# EAGLE schematic VSYNC_75px (EAGLE 9.4.2)
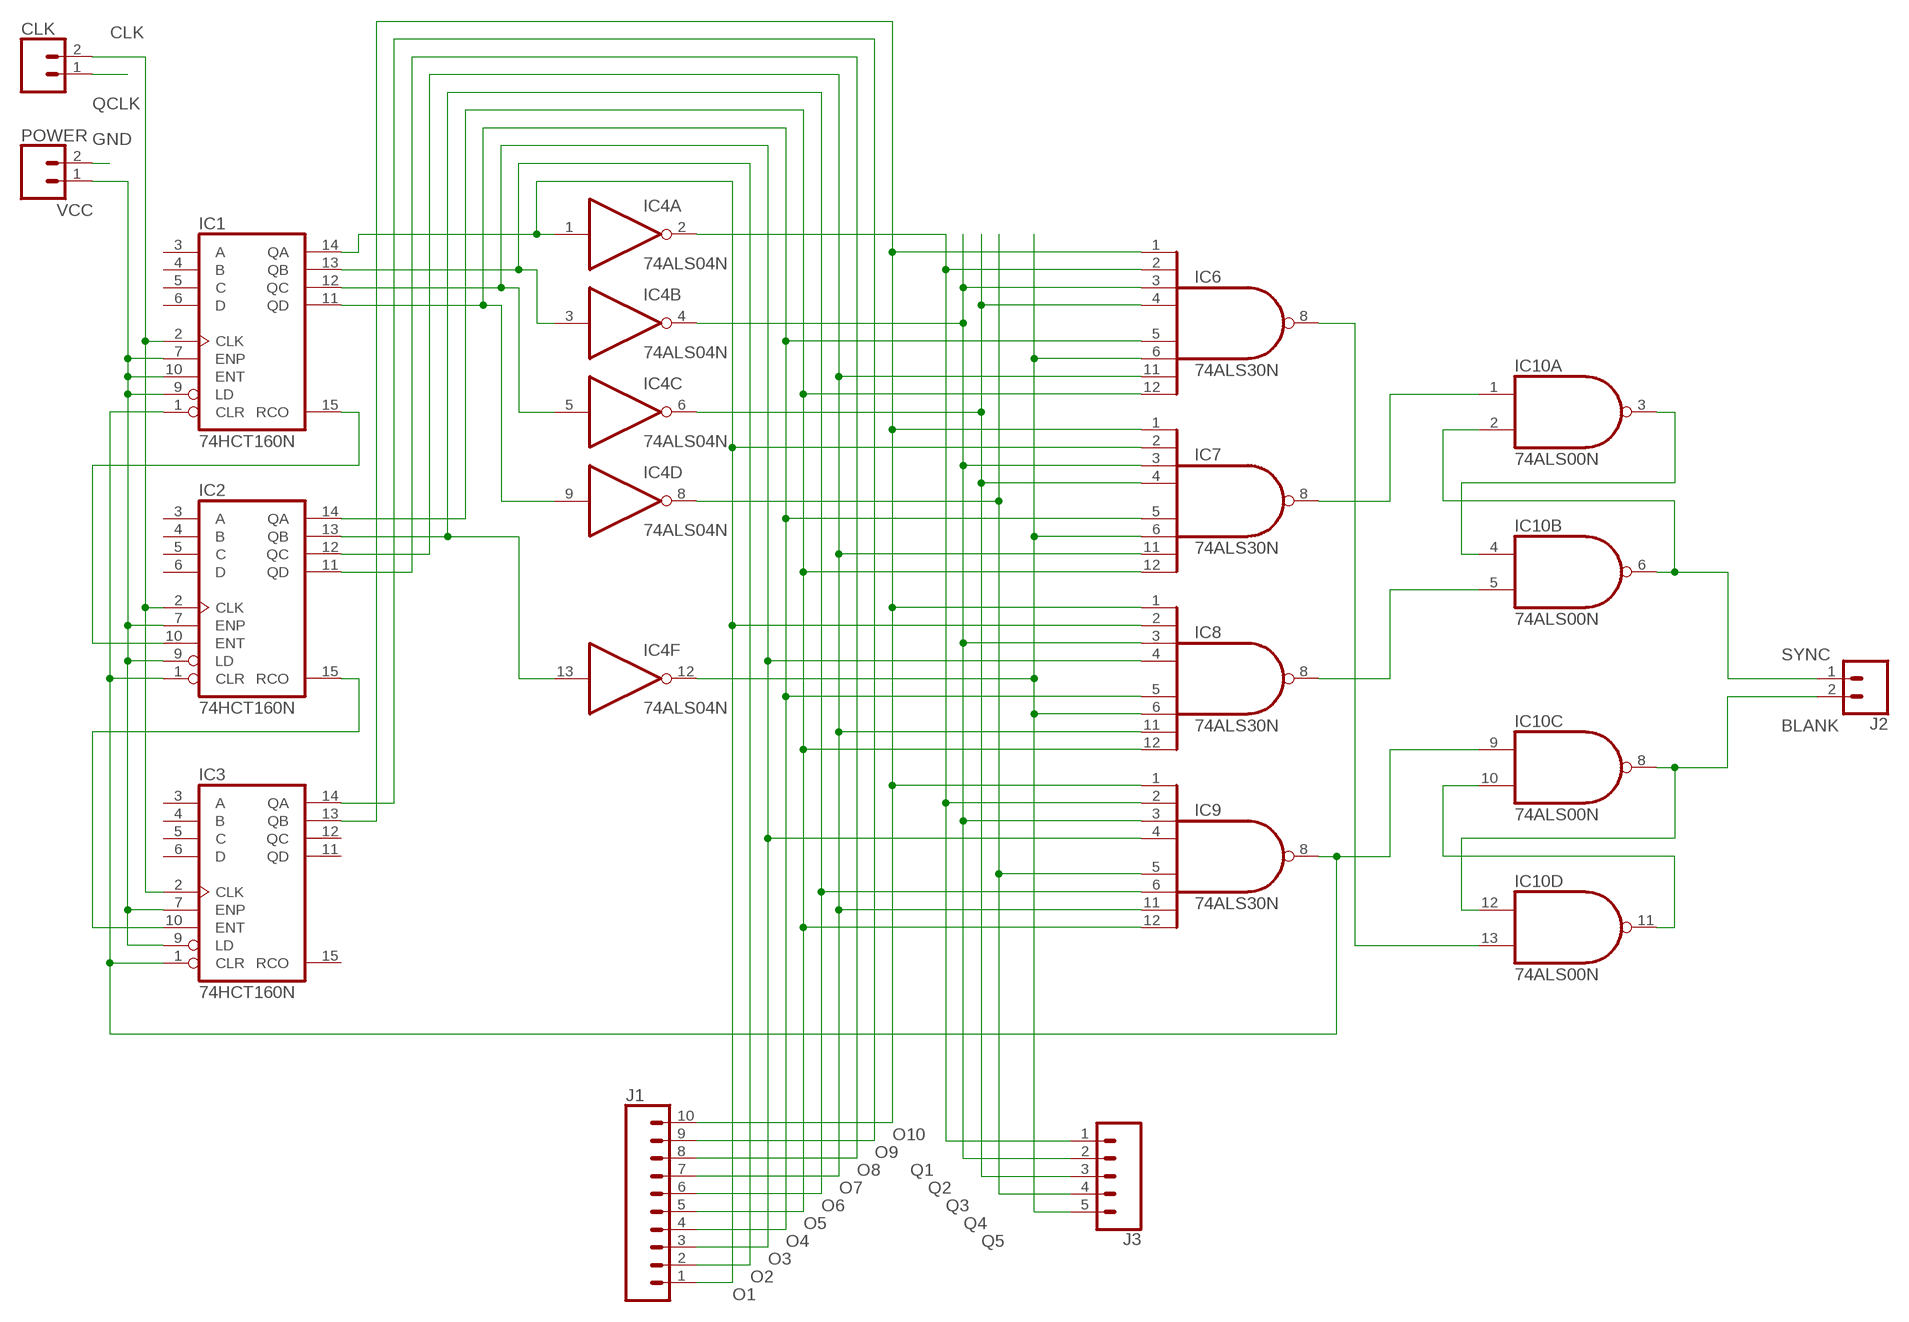
[diagram p0: schematic, sheet 1]

## Parts
CLK  CONN_02POGO_PIN_HOLES_ONLY  [1X02_PP_HOLES_ONLY]
IC1  74HCT160N  [DIL16]
IC2  74HCT160N  [DIL16]
IC3  74HCT160N  [DIL16]
IC4  74ALS04N  [DIL14]
IC6  74ALS30N  [DIL14]
IC7  74ALS30N  [DIL14]
IC8  74ALS30N  [DIL14]
IC9  74ALS30N  [DIL14]
IC10  74ALS00N  [DIL14]
J1  CONN_10"  [1X10]
J2  CONN_02POGO_PIN_HOLES_ONLY  [1X02_PP_HOLES_ONLY]
J3  CONN_05  [1X05]
POWER  CONN_02POGO_PIN_HOLES_ONLY  [1X02_PP_HOLES_ONLY]

## Nets
BLANK: IC10.8(C:O) IC10.12(D:I0) J2.2
CLK: CLK.2 IC1.2(CLK) IC2.2(CLK) IC3.2(CLK)
GND: POWER.2
MAX: IC1.1(CLR) IC2.1(CLR) IC3.1(CLR) IC9.8(O) IC10.9(C:I0)
N$3: IC1.15(RCO) IC2.10(ENT)
N$4: IC2.15(RCO) IC3.10(ENT)
N$24: IC7.8(O) IC10.1(A:I0)
N$25: IC8.8(O) IC10.5(B:I1)
N$26: IC10.3(A:O) IC10.4(B:I0)
N$28: IC6.8(O) IC10.13(D:I1)
N$32: IC10.10(C:I1) IC10.11(D:O)
O1: IC1.14(QA) IC4.1(A:I) IC7.2(I1) IC8.2(I1) J1.1
O2: IC1.13(QB) IC4.3(B:I) J1.2
O3: IC1.12(QC) IC4.5(C:I) IC8.4(I3) IC9.4(I3) J1.3
O4: IC1.11(QD) IC4.9(D:I) IC6.5(I4) IC7.5(I4) IC8.5(I4) J1.4
O5: IC2.14(QA) IC6.12(I7) IC7.12(I7) IC8.12(I7) IC9.12(I7) J1.5
O6: IC2.13(QB) IC4.13(F:I) IC9.6(I5) J1.6
O7: IC2.12(QC) IC6.11(I6) IC7.11(I6) IC8.11(I6) IC9.11(I6) J1.7
O8: IC2.11(QD) J1.8
O9: IC3.14(QA) J1.9
O10: IC3.13(QB) IC6.1(I0) IC7.1(I0) IC8.1(I0) IC9.1(I0) J1.10
Q1: IC4.2(A:O) IC6.2(I1) IC9.2(I1) J3.1
Q2: IC4.4(B:O) IC6.3(I2) IC7.3(I2) IC8.3(I2) IC9.3(I2) J3.2
Q3: IC4.6(C:O) IC6.4(I3) IC7.4(I3) J3.3
Q4: IC4.8(D:O) IC9.5(I4) J3.4
Q5: IC4.12(F:O) IC6.6(I5) IC7.6(I5) IC8.6(I5) J3.5
QCLK: CLK.1
SYNC: IC10.2(A:I1) IC10.6(B:O) J2.1
VCC: IC1.7(ENP) IC1.9(LD) IC1.10(ENT) IC2.7(ENP) IC2.9(LD) IC3.7(ENP) IC3.9(LD) POWER.1
Unconnected: IC1.3(A) IC1.4(B) IC1.5(C) IC1.6(D) IC2.3(A) IC2.4(B) IC2.5(C) IC2.6(D) IC3.3(A) IC3.4(B) IC3.5(C) IC3.6(D) IC3.11(QD) IC3.12(QC) IC3.15(RCO) IC4.10(E:O) IC4.11(E:I)

## Power pins joined to a net without a drawn wire
GND: IC1.8(GND) IC2.8(GND) IC3.8(GND) IC4.7(P:GND) IC6.7(GND) IC7.7(GND) IC8.7(GND) IC9.7(GND) IC10.7(P:GND)
VCC: IC1.16(VCC) IC2.16(VCC) IC3.16(VCC) IC4.14(P:VCC) IC6.14(VCC) IC7.14(VCC) IC8.14(VCC) IC9.14(VCC) IC10.14(P:VCC)

## Library data of the parts
CLK J2 POWER = SparkFun-Connectors:CONN_02: Multi connection point. Often used as Generic Header-pin footprint for 0.1 inch spaced/style header connections On any of the 0.1 inch spaced packages, you can populate with these: Break Away Headers - Straight <https://www.sparkfun.com/products/116> (PRT-00116) Break Away Male Headers - Right Angle <https://www.sparkfun.com/products/553> (PRT-00553) Female Headers <https://www.sparkfun.com/products/115> (PRT-00115) Break Away Headers - Machine Pin <https://www.sparkfun.com/products/117> (PRT-00117) Break Away Female Headers - Swiss Machine Pin <https://www.sparkfun.com/products/743> (PRT-00743) For SCREWTERMINALS and SPRING TERMINALS visit here: Screw Terimnals on SparkFun.com <https://www.sparkfun.com/search/results?term=Screw+Terminals> (5mm/3.5mm/2.54mm spacing) This device is also useful as a general connection point to wire up your design to another part of your project. Our various solder wires solder well into these plated through hole pads. Hook-Up Wire - Assortment (Stranded, 22 AWG) <https://www.sparkfun.com/products/11375> (PRT-11375) Hook-Up Wire - Assortment (Solid Core, 22 AWG) <https://www.sparkfun.com/products/11367> (PRT-11367) View the entire wire category on our website here <https://www.sparkfun.com/categories/141> Special notes: Molex polarized connector foot print use with: PRT-08233 with associated crimp pins and housings. 2.54_SCREWTERM for use with PRT-10571. 3.5mm Screw Terminal footprints for PRT-08084 5mm Screw Terminal footprints for use with PRT-08432
IC1-IC3 = 74xx-eu:74*160: Synchronous 4-bit COUNTER
IC4 = 74xx-us:74*04: Hex INVERTER
IC6-IC9 = 74xx-us:74*30: 8-input NAND gate
IC10 = 74xx-us:74*00: Quad 2-input NAND gate
J1 = SparkFun-Connectors:CONN_10: Multi connection point. Often used as Generic Header-pin footprint for 0.1 inch spaced/style header connections On any of the 0.1 inch spaced packages, you can populate with these: Break Away Headers - Straight <https://www.sparkfun.com/products/116> (PRT-00116) Break Away Male Headers - Right Angle <https://www.sparkfun.com/products/553> (PRT-00553) Female Headers <https://www.sparkfun.com/products/115> (PRT-00115) Break Away Headers - Machine Pin <https://www.sparkfun.com/products/117> (PRT-00117) Break Away Female Headers - Swiss Machine Pin <https://www.sparkfun.com/products/743> (PRT-00743) Arduino Stackable Header - 10 Pin <https://www.sparkfun.com/products/11376> (PRT-11376) For SCREWTERMINALS and SPRING TERMINALS visit here: Screw Terimnals on SparkFun.com <https://www.sparkfun.com/search/results?term=Screw+Terminals> (5mm/3.5mm/2.54mm spacing) This device is also useful as a general connection point to wire up your design to another part of your project. Our various solder wires solder well into these plated through hole pads. Hook-Up Wire - Assortment (Stranded, 22 AWG) <https://www.sparkfun.com/products/11375> (PRT-11375) Hook-Up Wire - Assortment (Solid Core, 22 AWG) <https://www.sparkfun.com/products/11367> (PRT-11367) View the entire wire category on our website here <https://www.sparkfun.com/categories/141> Special notes: Molex polarized connector foot print use with SKU : PRT-08231 with associated crimp pins and housings. 1MM SMD Version SKU: PRT-10208 NOTES ON THE VARIANTS LOCK and LOCK_LONGPADS... This footprint was designed to help hold the alignment of a through-hole component (i.e. 6-pin header) while soldering it into place. You may notice that each hole has been shifted either up or down by 0.005 of an inch from it's more standard position (which is a perfectly straight line). This slight alteration caused the pins (the squares in the middle) to touch the edges of the holes. Because they are alternating, it causes a "brace" to hold the component in place. 0.005 has proven to be the perfect amount of "off-center" position when using our standard breakaway headers. Although looks a little odd when you look at the bare footprint, once you have a header in there, the alteration is very hard to notice. Also,if you push a header all the way into place, it is covered up entirely on the bottom side.; PROD_ID: CONN-11563
J3 = SparkFun-Connectors:CONN_05: Multi connection point. Often used as Generic Header-pin footprint for 0.1 inch spaced/style header connections On any of the 0.1 inch spaced packages, you can populate with these: Break Away Headers - Straight <https://www.sparkfun.com/products/116> (PRT-00116) Break Away Male Headers - Right Angle <https://www.sparkfun.com/products/553> (PRT-00553) Female Headers <https://www.sparkfun.com/products/115> (PRT-00115) Break Away Headers - Machine Pin <https://www.sparkfun.com/products/117> (PRT-00117) Break Away Female Headers - Swiss Machine Pin <https://www.sparkfun.com/products/743> (PRT-00743) For SCREWTERMINALS and SPRING TERMINALS visit here: Screw Terimnals on SparkFun.com <https://www.sparkfun.com/search/results?term=Screw+Terminals> (5mm/3.5mm/2.54mm spacing) This device is also useful as a general connection point to wire up your design to another part of your project. Our various solder wires solder well into these plated through hole pads. Hook-Up Wire - Assortment (Stranded, 22 AWG) <https://www.sparkfun.com/products/11375> (PRT-11375) Hook-Up Wire - Assortment (Solid Core, 22 AWG) <https://www.sparkfun.com/products/11367> (PRT-11367) View the entire wire category on our website here <https://www.sparkfun.com/categories/141> Special notes: Molex polarized connector foot print use with SKU : PRT-08231 with associated crimp pins and housings. 1MM SMD Version SKU: PRT-10208